# EAGLE design Adafruit 3.5in 480x320 (EAGLE 6.3)
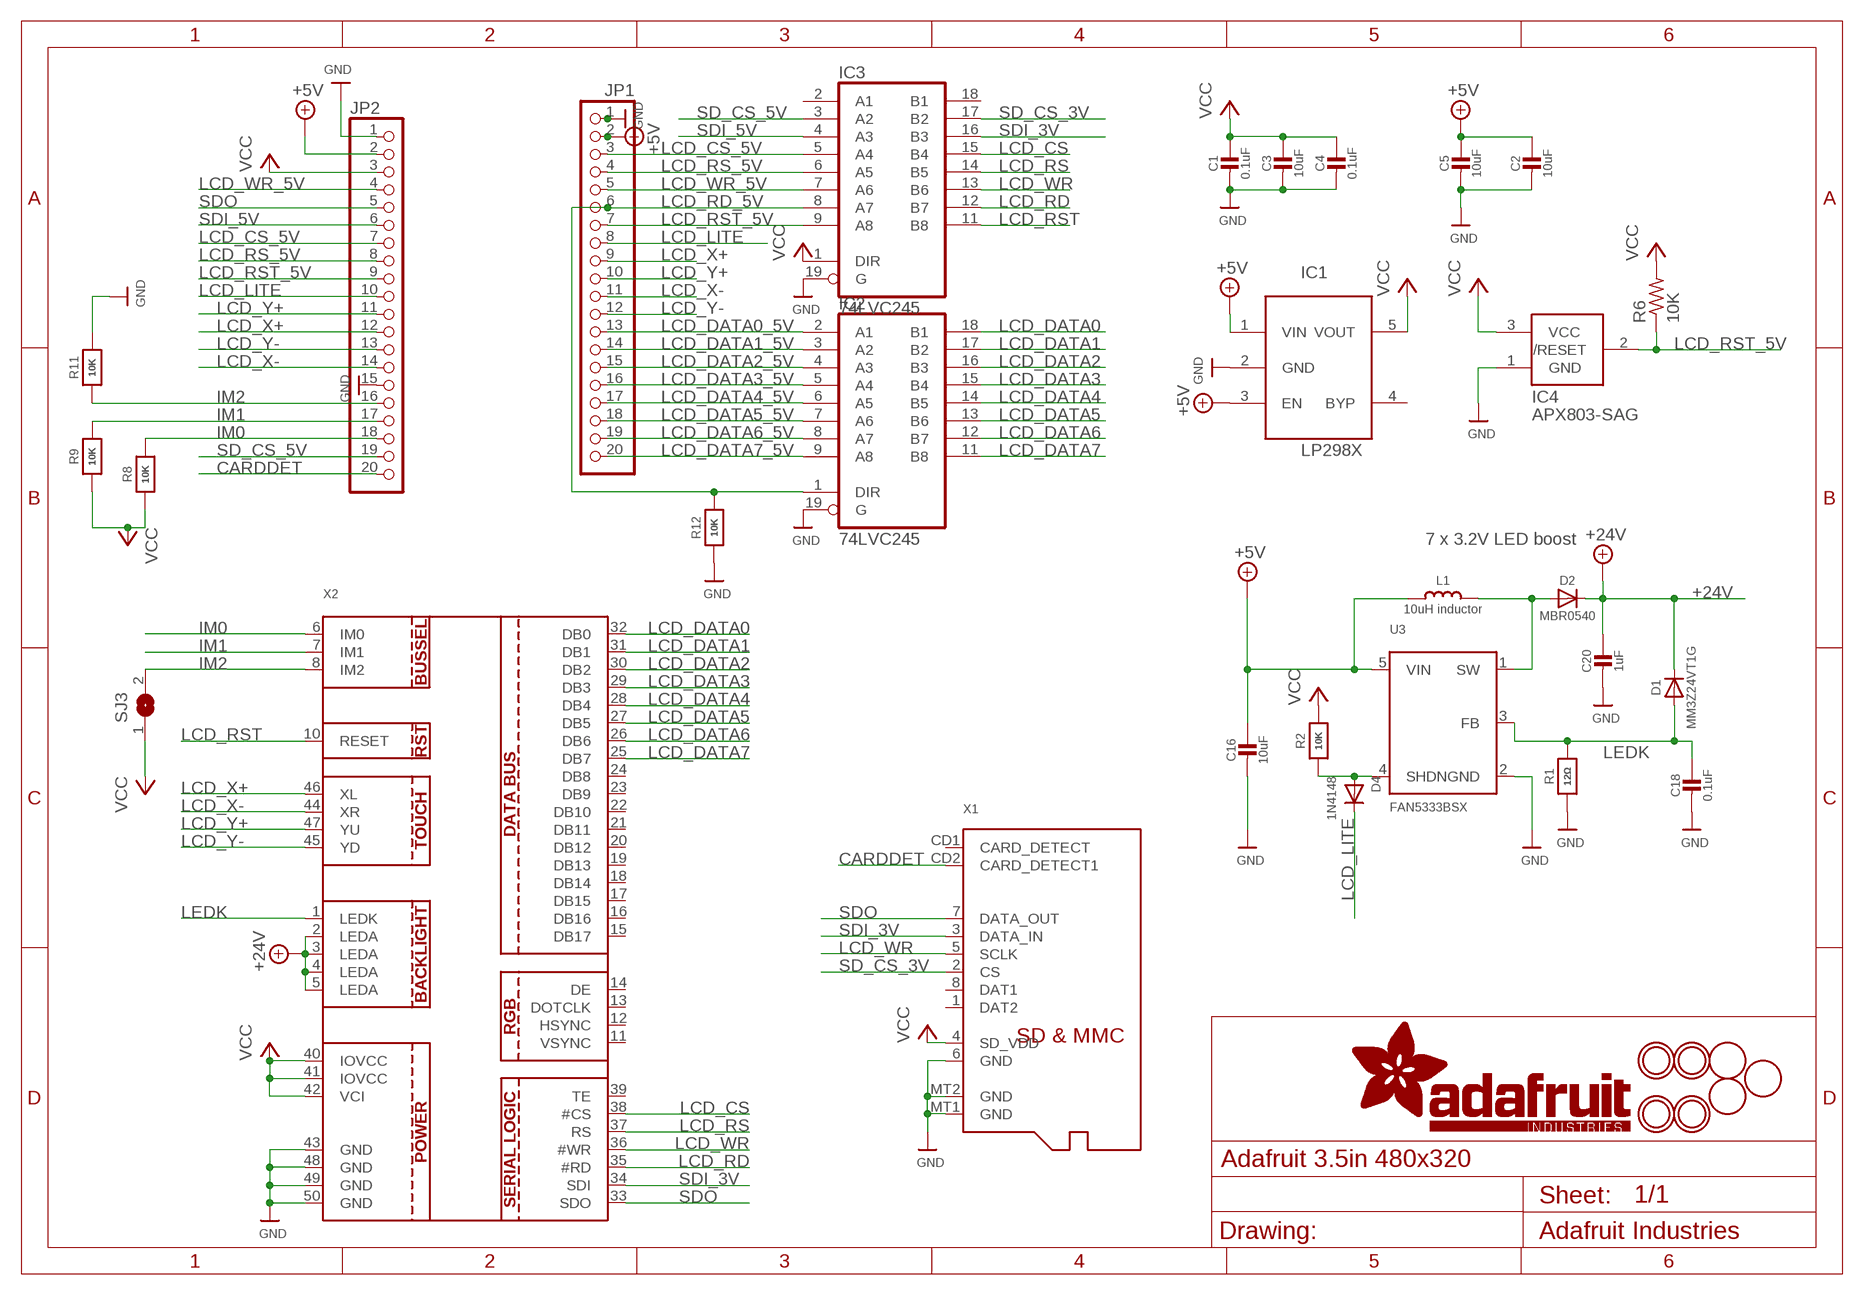
[diagram p0: schematic, sheet 1]

## Parts
C1  0.1uF  CAP_CERAMIC0805-NOOUTLINE  [0805-NO]
C2  10uF  CAP_CERAMIC0805-NOOUTLINE  [0805-NO]
C3  10uF  CAP_CERAMIC0805-NOOUTLINE  [0805-NO]
C4  0.1uF  CAP_CERAMIC0805-NOOUTLINE  [0805-NO]
C5  10uF  CAP_CERAMIC0805-NOOUTLINE  [0805-NO]
C16  10uF  CAP_CERAMIC_0805MP  [_0805MP]
C18  0.1uF  CAP_CERAMIC0805-NOOUTLINE  [0805-NO]
C20  1uF  CAP_CERAMIC0805-NOOUTLINE  [0805-NO]
D1  MM3Z24VT1G  DIODESMA  [SMADIODE]
D2  MBR0540  DIODESOD-123  [SOD-123]
D4  1N4148  DIODESOD-323F  [SOD-323F]
IC1  MIC5225-3.3  LP298XS  [SOT23-5L]
IC2  74LVC245  74ACT245DW  [SO20W]
IC3  74LVC245  74ACT245DW  [SO20W]
IC4  APX803-SAG  AXP083-SAG  [SOT23]
JP1  HEADER-1X20ROUND  [1X20_ROUND]
JP2  HEADER-1X20ROUND  [1X20_ROUND]
L1  10uH inductor  INDUCTORNR5040  [INDUCTOR_5X5MM_NR5040_NOTHERMALS]
R1  12Ω  RESISTOR_0805MP  [_0805MP]
R2  10K  RESISTOR0805_NOOUTLINE  [0805-NO]
R6  10K  R-US_R0805  [R0805]
R8  10K  RESISTOR0805_NOOUTLINE  [0805-NO]
R9  10K  RESISTOR0805_NOOUTLINE  [0805-NO]
R11  10K  RESISTOR0805_NOOUTLINE  [0805-NO]
R12  10K  RESISTOR0805_NOOUTLINE  [0805-NO]
SJ3  SOLDERJUMPER  [SOLDERJUMPER_ARROW_NOPASTE]
U3  FAN5333BSX  FAN5331  [SOT23-5@1]
U$7  MOUNTINGHOLE3.0THIN  [MOUNTINGHOLE_3.0_PLATEDTHIN]
U$9  FIDUCIAL  [FIDUCIAL_1MM]
U$11  FIDUCIAL  [FIDUCIAL_1MM]
U$15  MOUNTINGHOLE3.0THIN  [MOUNTINGHOLE_3.0_PLATEDTHIN]
U$16  MOUNTINGHOLE3.0THIN  [MOUNTINGHOLE_3.0_PLATEDTHIN]
U$17  MOUNTINGHOLE3.0THIN  [MOUNTINGHOLE_3.0_PLATEDTHIN]
U$23  FIDUCIAL  [FIDUCIAL_1MM]
X1  MICROSD  [MICROSD]
X2  DISP_LCD_3.5IN_320X480_50PIN  [TFT_3.5IN_320X480_50PIN]

## Nets
+5V: C2.1 C5.1 C16.1 IC1.1(VIN) IC1.3(EN) JP1.2 JP2.2 L1.P$1 U3.5(VIN)
+24V: C20.1 D1.C D2.C X2.2(LEDA) X2.3(LEDA) X2.4(LEDA) X2.5(LEDA)
CARDDET: JP2.20 X1.CD2(CARD_DETECT1)
GND: C1.2 C2.2 C3.2 C4.2 C5.2 C16.2 C18.2 C20.2 IC1.2(GND) IC2.19(G) IC3.19(G) IC4.1(GND) JP1.1 JP2.1 JP2.15 R1.1 R11.2 R12.1 U3.2(GND) X1.6(GND) X1.MT1(GND) X1.MT2(GND) X2.43(GND) X2.48(GND) X2.49(GND) X2.50(GND)
IM0: JP2.18 R8.2 X2.6(IM0)
IM1: JP2.17 R9.2 X2.7(IM1)
IM2: JP2.16 R11.1 SJ3.2 X2.8(IM2)
LCD_CS: IC3.15(B4) X2.38(#CS)
LCD_CS_5V: IC3.5(A4) JP1.3 JP2.7
LCD_DATA0: IC2.18(B1) X2.32(DB0)
LCD_DATA0_5V: IC2.2(A1) JP1.13
LCD_DATA1: IC2.17(B2) X2.31(DB1)
LCD_DATA1_5V: IC2.3(A2) JP1.14
LCD_DATA2: IC2.16(B3) X2.30(DB2)
LCD_DATA2_5V: IC2.4(A3) JP1.15
LCD_DATA3: IC2.15(B4) X2.29(DB3)
LCD_DATA3_5V: IC2.5(A4) JP1.16
LCD_DATA4: IC2.14(B5) X2.28(DB4)
LCD_DATA4_5V: IC2.6(A5) JP1.17
LCD_DATA5: IC2.13(B6) X2.27(DB5)
LCD_DATA5_5V: IC2.7(A6) JP1.18
LCD_DATA6: IC2.12(B7) X2.26(DB6)
LCD_DATA6_5V: IC2.8(A7) JP1.19
LCD_DATA7: IC2.11(B8) X2.25(DB7)
LCD_DATA7_5V: IC2.9(A8) JP1.20
LCD_LITE: D4.C JP1.8 JP2.10
LCD_RD: IC3.12(B7) X2.35(#RD)
LCD_RD_5V: IC2.1(DIR) IC3.8(A7) JP1.6 R12.2
LCD_RS: IC3.14(B5) X2.37(RS)
LCD_RS_5V: IC3.6(A5) JP1.4 JP2.8
LCD_RST: IC3.11(B8) X2.10(RESET)
LCD_RST_5V: IC3.9(A8) IC4.2(/RESET) JP1.7 JP2.9 R6.1
LCD_WR: IC3.13(B6) X1.5(SCLK) X2.36(#WR)
LCD_WR_5V: IC3.7(A6) JP1.5 JP2.4
LCD_X+: JP1.9 JP2.12 X2.46(XL)
LCD_X-: JP1.11 JP2.14 X2.44(XR)
LCD_Y+: JP1.10 JP2.11 X2.47(YU)
LCD_Y-: JP1.12 JP2.13 X2.45(YD)
LEDK: C18.1 D1.A R1.2 U3.3(FB) X2.1(LEDK)
N$3: D2.A L1.P$2 U3.1(SW)
SD_CS_3V: IC3.17(B2) X1.2(CS)
SD_CS_5V: IC3.3(A2) JP2.19
SDI_3V: IC3.16(B3) X1.3(DATA_IN) X2.34(SDI)
SDI_5V: IC3.4(A3) JP2.6
SDO: JP2.5 X1.7(DATA_OUT) X2.33(SDO)
SHDN: D4.A R2.1 U3.4(SHDN)
VCC: C1.1 C3.1 C4.1 IC1.5(VOUT) IC3.1(DIR) IC4.3(VCC) JP2.3 R2.2 R6.2 R8.1 R9.1 SJ3.1 X1.4(SD_VDD) X2.40(IOVCC) X2.41(IOVCC) X2.42(VCI)
Unconnected: IC1.4(BYP) IC3.2(A1) IC3.18(B1) X1.1(DAT2) X1.8(DAT1) X1.CD1(CARD_DETECT) X2.11(VSYNC) X2.12(HSYNC) X2.13(DOTCLK) X2.14(DE) X2.15(DB17) X2.16(DB16) X2.17(DB15) X2.18(DB14) X2.19(DB13) X2.20(DB12) X2.21(DB11) X2.22(DB10) X2.23(DB9) X2.24(DB8) X2.39(TE)

## Notes on the sheet
- 7 x 3.2V LED boost

## Power pins joined to a net without a drawn wire
GND: IC2.10(GND) IC3.10(GND)
VCC: IC2.20(VCC) IC3.20(VCC)

## Library data of the parts
C1-C5 C16 C18 C20 = microbuilder:CAP_CERAMIC: Ceramic Capacitors For new designs, use the packages preceded by an '_' character since they are more reliable: The following footprints should be used on most boards: _0402 - Standard footprint for regular board layouts _0603 - Standard footprint for regular board layouts _0805 - Standard footprint for regular board layouts _1206 - Standard footprint for regular board layouts For extremely tight-pitch boards where space is at a premium, the following 'micro-pitch' footprints can be used (smaller pads, no silkscreen outline, etc.): _0402MP - Micro-pitch footprint for very dense/compact boards _0603MP - Micro-pitch footprint for very dense/compact boards _0805MP - Micro-pitch footprint for very dense/compact boards _1206MP - Micro-pitch footprint for very dense/compact boards
D1 D2 = microbuilder:DIODE: Diode
D4 = adafruit:DIODE: Diode
IC1 = adafruit:LP298X
IC2 IC3 = 74xx-eu:74*245: Octal BUS TRANSCEIVER, 3-state
IC4 = adafruit:AXP083
JP1 JP2 = microbuilder:HEADER-1X20
L1 = microbuilder:INDUCTOR: Inductors 0603: 10nH Ceramic Inductor - microwire antenna/RF (Digikey: 712-1434-2-ND) 0805: 560nH Ceramic Inductor - RF (Digikey: 553-1047-1-ND) 270nH Ceramic Inductor - Q = 40@250MHz, +-5%, 1 Ohm DC Resistance (Digikey: 535-10506-2-ND) 1007 (2518 Metric) SMT: 10µH 10% 250mOhm 820mA 1007 Inductor (Digikey: 587-2189-1-ND) 22µH 10% 500mOhm 580mA 1007 Inductor (Digikey: 587-2190-1-ND) 47µH 10% 950mOhm 420mA 1007 Inductor (Digikey: 587-2191-1-ND) 47µH 5% 100mOhm 1A 1008 Inductor (Digikey: 732-1816-1-ND) 5.0x5.0mm (Taiyo Yuden NR5040 Series) 6.8µH 20% 2.3A 64mOhm Inductor (Digikey: 587-2374-2-ND) 5.0x5.0mm (TDK VLC5045 Series) 4.7µH 20% 3.3A 34mOhm Inductor (Digikey: 445-6526-1-ND) 6.8µH 20% 2.7A 46mOhm Inductor (Digikey: 445-6527-1-ND) 6.0x6.0mm (TDK VLC6045 Series) 4.7µH 20% 3.8A 27mOhm Inductor (Digikey: 445-6538-2-ND) 6.8µH 20% 3A 41mOhm Inductor (Digikey: 445-6540-1-ND) 6.2µH 30% 2.2A 45mOhm Inductor (Digikey: SRR5028-6R2YCT-ND) - Not TDK VLC6045 but footprint should match 6.0x6.0mm (TDK SLF6045 Series) 6.8uH 30% 2A 33mOhm Inductor (Digikey: 445-4572-1-ND, Mouser: 810-SLF645T6R8N2R0PF) 6.0x6.0mm (Sumida CDRH5D28 Series) 6.2uH 30% 1.8A 45mOhm Inductor (Digikey: 308-1542-1-ND) Taiyo Yuden NR3015T2R2M - 2.2uH 20% 1.5A (Digikey: 587-1648-2-ND, Mouser: 963-NR3015T2R2M) - Used with TI TPS62172 CoilCraft RFID Transponder Coil - MA5532-AE (For use with AS3935 Lightning Sensor)
R1 R2 R8 R9 R11 R12 = microbuilder:RESISTOR: Resistors For new designs, use the packages preceded by an '_' character since they are more reliable: The following footprints should be used on most boards: _0402 - Standard footprint for regular board layouts _0603 - Standard footprint for regular board layouts _0805 - Standard footprint for regular board layouts _1206 - Standard footprint for regular board layouts For extremely tight-pitch boards where space is at a premium, the following 'micro-pitch' footprints can be used (smaller pads, no silkscreen outline, etc.): _0402MP - Micro-pitch footprint for very dense/compact boards _0603MP - Micro-pitch footprint for very dense/compact boards _0805MP - Micro-pitch footprint for very dense/compact boards _1206MP - Micro-pitch footprint for very dense/compact boards
R6 = rcl:R-US_: RESISTOR, American symbol
SJ3 = microbuilder:SOLDERJUMPER: SMD Solder JUMPER Solder the two pads together to create a connection, or remove the solder to break it. REFLOW - Use this footprint for solder paste and reflow ovens. WAVE - Use this footprint for hand-soldering (larger pads). CLOSED - Has a trace between the two pads to ensure it is closed by default. The trace needs to be cut to disable the jumper, and can be closed again by creating a solder bridge between the two pads.; BOM: EXCLUDE
U3 = microbuilder:FAN5331: FAN5331 - LED/OLED 20V Boost Converter Digikey: FAN5331SXCT-ND
U$7 U$15-U$17 = microbuilder:MOUNTINGHOLE: Mounting Hole For #2 screws (0.086"/2.18mm width, 0.094"/2.4mm hole) use 2.5mm; BOM: EXCLUDE
U$9 U$11 U$23 = adafruit:FIDUCIAL: For use by pick and place machines to calibrate the vision/machine, 1mm By microbuilder.eu
X1 = microbuilder:MICROSD: MicroSD/Transflash Card Holder with SPI pinout 3M: 2908-05WB-MG 4UConnector: 19656 Footprint courtesy: Adafruit Industries
X2 = microbuilder:DISP_LCD_3.5IN_320X480_50PIN: DT350HV15-T - 3.5" 320x480 TFT Display, 50 Pin Connector

## Board
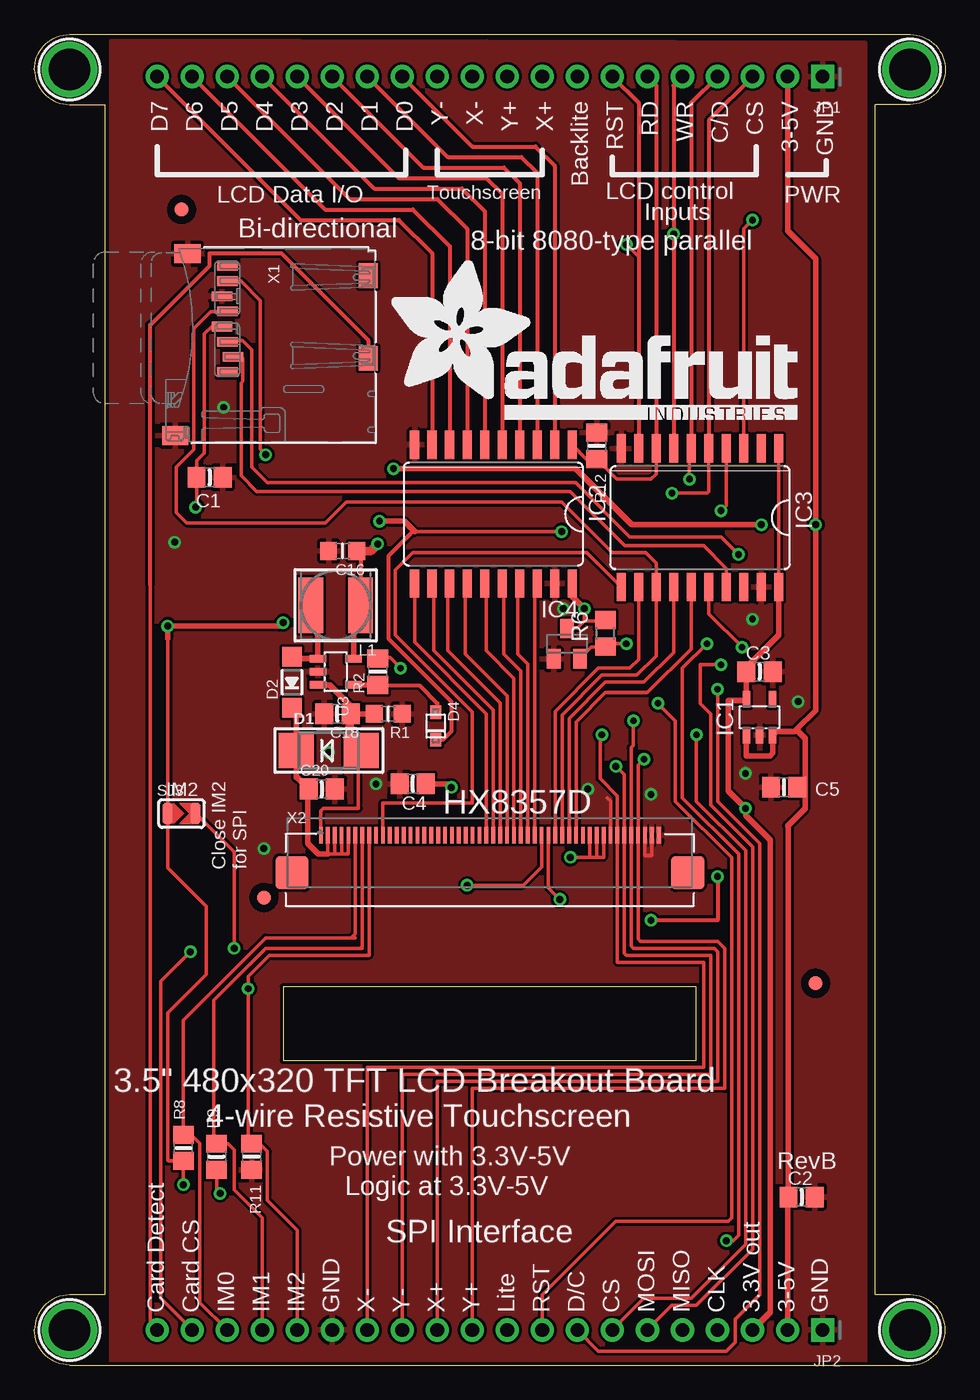
[diagram p1: board, top side]
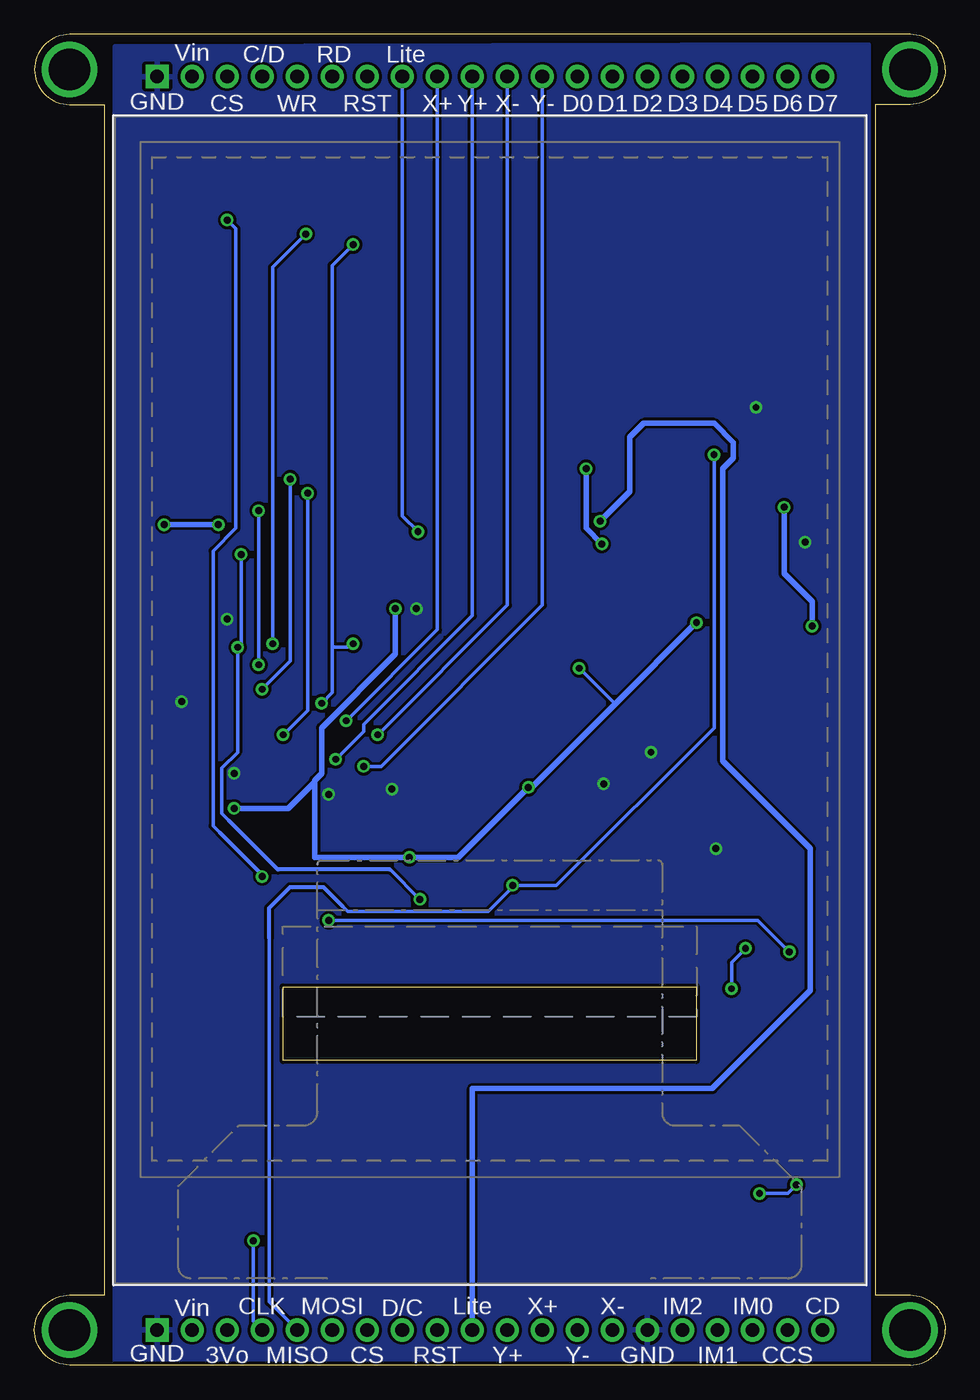
[diagram p2: board, bottom side, seen from below]

Size 66.04 x 96.52 mm. Coordinates in mm from the lower left corner, seen from the top.
Outline: 2.54,0 63.5,0 arc90 66.04,2.54 arc90 63.5,5.08 60.96,5.08 60.96,91.44 63.5,91.44 arc90 66.04,93.98 arc90 63.5,96.52 2.54,96.52 arc90 0,93.98 arc90 2.54,91.44 5.08,91.44 5.08,5.08 2.54,5.08 arc90 0,2.54 arc90 2.54,0
Outline: 18.03,27.43 18.03,22.1 48.01,22.1 48.01,27.43 18.03,27.43
Copper layers (1*16): Top 0.035mm / dielectric 1.5mm / Bottom 0.035mm
Design rules "adafruit": minimum track width 8mil, minimum drill 15.5mil, track to track 8mil, track to pad 8mil, pad to pad 8mil, via to via 8mil, smd to smd 8mil, copper to edge 10mil, drill to drill 8mil, minimum pad ring 10mil, minimum via ring 8mil, stop-mask expansion 2mil, vias tented up to drill 20mil, thermal gap 10mil
tRestrict: area 44.5,38.2 to 44.6,38.6; area 45,38.2 to 45.1,38.6

### Footprints (pad centres in the part's own frame; a part is rotated, then mirrored left to right if it is on the bottom)
0805-NO = smd 1.3 x 1.5: 1 -0.95,0; 2 0.95,0
_0805MP = smd 1.2 x 1.3: 1 -1.016,0; 2 1.016,0
SMADIODE = smd 2.54 x 2.54: A 2.349,0; C -2.349,0
SOD-123 = smd 1.4 x 1.4: A 1.85,0; C -1.85,0
SOD-323F = smd 1 x 0.8: A -1,0; C 1,0
SOT23-5L = smd 0.55 x 1.2: 1 -0.95,-1.3; 2 0,-1.3; 3 0.95,-1.3; 4 0.95,1.3; 5 -0.95,1.3
SO20W = smd 0.66 x 2.032: 1 -5.715,-5.029; 2 -4.445,-5.029; 3 -3.175,-5.029; 4 -1.905,-5.029; 5 -0.635,-5.029; 6 0.635,-5.029; 7 1.905,-5.029; 8 3.175,-5.029; 9 4.445,-5.029; 10 5.715,-5.029; 11 5.715,5.029; 12 4.445,5.029; 13 3.175,5.029; 14 1.905,5.029; 15 0.635,5.029; 16 -0.635,5.029; 17 -1.905,5.029; 18 -3.175,5.029; 19 -4.445,5.029; 20 -5.715,5.029
SOT23 = smd 1 x 1.4: 1 -0.95,-1.1; 2 0.95,-1.1; 3 0,1.1
1X20_ROUND = drill 1 pad 1.676 square: 1 -24.13,0 | drill 1 pad 1.676: 2 -21.59,0; 3 -19.05,0; 4 -16.51,0; 5 -13.97,0; 6 -11.43,0; 7 -8.89,0; 8 -6.35,0; 9 -3.81,0; 10 -1.27,0; 11 1.27,0; 12 3.81,0; 13 6.35,0; 14 8.89,0; 15 11.43,0; 16 13.97,0; 17 16.51,0; 18 19.05,0; 19 21.59,0; 20 24.13,0
INDUCTOR_5X5MM_NR5040_NOTHERMALS = smd 1.8 x 4: P$1 -1.8,0; P$2 1.8,0
R0805 = smd 1.3 x 1.5: 1 -0.95,0; 2 0.95,0
SOLDERJUMPER_ARROW_NOPASTE = smd 0.762 x 1.524: 1 -1.016,0; 2 1.016,0
SOT23-5@1 = smd 0.55 x 1.2: 1 -0.95,-1.3; 2 0,-1.3; 3 0.95,-1.3; 4 0.95,1.3; 5 -0.95,1.3
MOUNTINGHOLE_3.0_PLATEDTHIN = drill 3 pad 3.6: P$1 0,0
FIDUCIAL_1MM = smd 1 x 1: 1 0,0
MICROSD = smd 0.7 x 1.5: 1 9,-10.64; 2 7.9,-10.24; 3 6.8,-10.64; 4 5.7,-11.04; 5 4.6,-10.64; 6 3.5,-11.04; 7 2.4,-10.64; 8 1.3,-10.64 | smd 1.8 x 1.4: CD1 2,-0.44; CD2 8,-0.44 | smd 1.4 x 1.9: MT1 0.4,-13.54; MT2 13.6,-14.44
TFT_3.5IN_320X480_50PIN = smd 0.275 x 1.2 bottom: 1 12.25,-4.76; 2 11.75,-4.76; 3 11.25,-4.76; 4 10.75,-4.76; 5 10.25,-4.76; 6 9.75,-4.76; 7 9.25,-4.76; 8 8.75,-4.76; 9 8.25,-4.76; 10 7.75,-4.76; 11 7.25,-4.76; 12 6.75,-4.76; 13 6.25,-4.76; 14 5.75,-4.76; 15 5.25,-4.76; 16 4.75,-4.76; 17 4.25,-4.76; 18 3.75,-4.76; 19 3.25,-4.76; 20 2.75,-4.76; 21 2.25,-4.76; 22 1.75,-4.76; 23 1.25,-4.76; 24 0.75,-4.76; 25 0.25,-4.76; 26 -0.25,-4.76; 27 -0.75,-4.76; 28 -1.25,-4.76; 29 -1.75,-4.76; 30 -2.25,-4.76; 31 -2.75,-4.76; 32 -3.25,-4.76; 33 -3.75,-4.76; 34 -4.25,-4.76; 35 -4.75,-4.76; 36 -5.25,-4.76; 37 -5.75,-4.76; 38 -6.25,-4.76; 39 -6.75,-4.76; 40 -7.25,-4.76; 41 -7.75,-4.76; 42 -8.25,-4.76; 43 -8.75,-4.76; 44 -9.25,-4.76; 45 -9.75,-4.76; 46 -10.25,-4.76; 47 -10.75,-4.76; 48 -11.25,-4.76; 49 -11.75,-4.76; 50 -12.25,-4.76 | smd 2.4 x 2.4 bottom: PAD1 14.35,-7.46; PAD2 -14.35,-7.46

### Placement (x,y rotation side)
C1  12.7,64.39 0 top
C2  55.63,12.19 0 top
C3  52.58,50.29 0 top
C4  27.43,42.16 180 top
C5  54.36,41.91 180 top
C16  22.35,59.05 180 top
C18  21.97,47.24 180 top
C20  20.83,41.78 0 top
D1  21.34,44.58 0 top
D2  18.67,49.53 90 top
D4  29.08,46.35 270 top
IC1  52.58,46.99 0 top
IC2  33.27,61.72 180 top
IC3  48.26,61.47 180 top
IC4  38.61,52.32 0 top
JP1  33.02,93.47 180 top
JP2  33.02,2.54 180 top
L1  21.84,55.12 180 top
R1  25.65,47.24 180 top
R2  24.89,50.29 90 top
R6  41.4,53.09 90 top
R8  10.8,15.75 90 top
R9  13.21,15.11 90 top
R11  15.75,15.11 270 top
R12  40.77,66.67 270 top
SJ3  10.67,40.01 0 top
U3  21.84,50.29 270 top
U$7  2.54,2.54 0 top
U$9  56.64,27.69 0 top
U$11  10.67,83.82 0 top
U$15  63.5,2.54 0 top
U$16  2.54,93.98 0 top
U$17  63.5,93.98 0 top
U$19  [ADAFRUIT_TEXT_30MM]  25.65,68.58 0 top
U$23  16.64,33.91 0 top
X1  24.64,81.03 270 top
X2  33.02,43.18 0 bottom

### Tracks (layer width: path | path; a pad name or v marks a point on that pad's centre or on a via)
+5V  (via drill 0.5)
  Top 0.305: C16.1 23.64,58.78 L1.P$1
  Top 0.406: JP1.2 54.61,82.3 56.64,80.26 v56.64,60.96 56.64,47.5 55.25,46.1 | 55.25,46.1 55.12,45.97 53.81,45.97 IC1.3 53.53,44.38 53.34,44.2 51.63,44.2 IC1.1 | 55.88,41.91 55.88,40.39 54.61,39.12 54.68,39.05 C2.1 54.61,12.13 JP2.2 54.63,2.56 | 55.88,41.91 55.88,45.47 55.25,46.1 | C5.1 55.88,41.91 | L1.P$1 23.14,55.12 U3.5 | v26.04,65.02 39.24,65.02 43.31,60.96 v52.7,60.96
  Top 0.61: C16.1 24.38,59.05 v24.89,59.56
  Bottom 0.254: 54.61,92.84 JP1.2
  Bottom 0.406: v24.89,59.56 26.04,60.71 v26.04,65.02 | v52.7,60.96 v56.64,60.96
+24V
  Top 0.254: X2.2 21.27,37.08 21.77,37.08 | 22.77,38.1 X2.5 22.77,37.08 22.27,37.08 | 22.27,38.14 X2.4 22.27,37.08 | X2.3 21.77,37.08 | 22.27,37.08 21.77,37.08
  Top 0.406: D2.C 18.99,47.36 D1.C 18.99,42.61 19.05,42.61 C20.1 19.81,41.72 19.81,37.85 20.57,37.08 21.27,37.08
CARDDET
  Top 0.254: JP2.20 8.38,3.05 8.38,56.64
  Top 0.305: 8.38,56.64 8.38,75.44 12.7,79.76 12.7,80.65 17.91,80.65 24.2,74.35 X1.CD2
GND  (via drill 0.5)
  Top 0.254: X2.43 41.77,40.91 41.53,41.15 | X2.48 44.27,36.96 44.77,36.96 X2.49
  other vias: 38.35,54.86 52.07,54.1 40.13,41.78 44.7,41.4 51.56,42.93 55.37,48.13 16.64,37.47 10.16,59.69 21.34,44.45 24.77,42.16 13.72,69.47
  pour Top: 5.59,96.01 5.59,0 60.2,-0.13 60.2,95.88
  pour Bottom: 5.59,95.76 5.59,-0.25 60.2,-0.38 60.2,95.63
IM0
  Top 0.254: 22.99,30.99 16.76,30.99 10.8,25.02 R8.2 11.37,16.7 12,16.07 12,4.51 JP2.18 | 22.99,30.99 23.27,30.99 | X2.6 23.27,31.27 22.99,30.99
IM1
  Top 0.254: 23.77,30.23 23.62,30.23 | 23.62,30.23 16.76,30.23 13,26.47 13,16.27 R9.2 14.04,16.06 14.48,15.62 14.48,12.7 16.51,10.67 JP2.17 | X2.7 23.77,30.37 23.62,30.23
IM2  (via drill 0.5)
  Top 0.254: JP2.16 19.05,9.78 16.89,11.94 16.89,15.49 16.26,16.13 15.81,16.13 R11.1 15.49,16.32 v15.49,27.3 15.49,28.19 17.02,29.72 24.27,29.72 X2.8 | SJ3.2 14.48,37.21 v14.48,30.23
  Bottom 0.254: v14.48,30.23 15.49,29.21 v15.49,27.3
LCD_CS
  Top 0.254: 47.75,56.31 IC3.15 47.62,51.94 44.45,48.77 41.4,48.77 39.27,46.64 X2.38
LCD_CS_5V  (via drill 0.5)
  Top 0.254: JP2.7 44.2,4.83 47.62,4.83 51.56,8.76 51.56,37.34 48.01,40.89 v48.01,45.72 | v46.23,63.25 48.77,63.25 48.9,63.37 IC3.5
  Top 0.305: JP1.3 48.9,90.3 IC3.5
  Bottom 0.254: v48.01,45.72 46.23,47.5 v46.23,63.25
LCD_DATA0
  Top 0.254: IC2.18 36.27,56.51 X2.32
LCD_DATA0_5V
  Top 0.305: JP1.13 31.75,88.39 36.32,88.39 37.72,87 IC2.2
LCD_DATA1
  Top 0.254: IC2.17 35.05,56.57 35.05,51.56 35.77,50.84 X2.31
LCD_DATA1_5V
  Top 0.305: JP1.14 29.97,87.63 35.31,87.63 36.45,86.49 IC2.3
LCD_DATA2
  Top 0.254: IC2.16 34.04,56.57 34.04,51.56 35.27,50.33 X2.30
LCD_DATA2_5V
  Top 0.305: JP1.15 28.19,86.87 34.04,86.87 35.18,85.72 IC2.4
LCD_DATA3
  Top 0.254: IC2.15 32.77,56.57 32.77,51.82 34.77,49.81 X2.29
LCD_DATA3_5V
  Top 0.305: JP1.16 26.42,86.11 32.77,86.11 33.91,84.96 IC2.5
LCD_DATA4
  Top 0.254: IC2.14 31.24,56.57 31.24,51.56 34.27,48.53 X2.28
LCD_DATA4_5V
  Top 0.305: JP1.17 24.64,85.34 30.99,85.34 32.64,83.69 IC2.6
LCD_DATA5
  Top 0.254: IC2.13 29.97,56.57 29.97,51.82 33.77,48.02 X2.27
LCD_DATA5_5V
  Top 0.305: JP1.18 22.86,84.58 29.21,84.58 31.37,82.42 IC2.7
LCD_DATA6
  Top 0.254: IC2.12 28.96,56.57 28.96,51.82 33.27,47.5 X2.26
LCD_DATA6_5V
  Top 0.305: JP1.19 21.08,83.82 27.43,83.82 30.1,81.15 IC2.8
LCD_DATA7
  Top 0.254: IC2.11 27.56,52.45 32.77,47.24 X2.25
LCD_DATA7_5V
  Top 0.305: JP1.20 19.3,83.06 26.42,83.06 28.83,80.65 IC2.9
LCD_LITE  (via drill 0.5)
  Top 0.254: 27.43,60.45 27.56,60.45 v38.23,60.45
  Top 0.305: 27.43,60.45 25.65,58.67 25.65,52.7 30.23,48.13 30.23,45.97 29.61,45.35 D4.C
  Top 0.406: v25.02,61.21 26.8,61.21 27.56,60.45
  Bottom 0.254: v38.23,60.45 39.37,61.59 JP1.8
  Bottom 0.406: JP2.10 34.29,20.07 16.89,20.07 9.78,27.18 9.78,37.47 16.13,43.81 16.13,65.02 15.37,65.79 15.37,66.93 16.76,68.33 21.84,68.33 22.86,67.31 22.86,63.37 v25.02,61.21
LCD_RD
  Top 0.254: 43.69,56.31 IC3.12 43.82,51.18 43.18,50.55 40.89,50.55 37.77,47.42 X2.35
LCD_RD_5V
  Top 0.254: IC2.1 40.02,65.72 R12.2 42.23,64.26 44.7,64.26 45.09,64.64 IC3.8
  Top 0.305: JP1.6 45.09,92.84 IC3.8
LCD_RS
  Top 0.254: 46.23,56.31 IC3.14 46.36,51.69 44.2,49.53 41.4,49.53 38.77,46.9 X2.37
LCD_RS_5V  (via drill 0.5)
  Top 0.254: v49.53,49.02 49.53,40.89 52.58,37.85 52.58,5.08 50.8,3.3 50.8,1.65 50.17,1.02 40.89,1.02 JP2.8 | IC3.6 47.5,66.37 v47.5,64.26
  Top 0.305: JP1.4 47.62,91.57 IC3.6
  Bottom 0.254: v49.53,49.02 47.5,51.05 v47.5,64.26
LCD_RST
  Top 0.254: IC3.11 40.06,58.93 27.43,58.93 26.16,57.66 26.16,52.96 31.75,47.37 31.75,40.77 25.27,40.77 X2.10
LCD_RST_5V  (via drill 0.5)
  Top 0.254: v45.21,48.01 46.48,46.74 46.48,40.89 50.55,36.83 50.55,10.67 50.29,10.41 42.16,10.41 36.83,5.08 JP2.9 | v42.93,81.28 43.82,80.39 IC3.9 | v42.93,52.32 41.59,52.32 R6.1 41.34,52.07 40.37,52.07 39.56,51.26 IC4.2
  Top 0.305: JP1.7 43.82,91.57 IC3.9
  Bottom 0.254: v45.21,48.01 44.45,48.77 44.45,52.07 | 44.45,52.07 44.45,79.76 v42.93,81.28 | v42.93,52.32 43.18,52.07 44.45,52.07
LCD_WR
  Top 0.254: 45.21,56.31 IC3.13 | IC3.13 45.09,51.44 43.69,50.04 41.15,50.04 38.27,47.16 X2.36 | X1.5 12.8,76.43 11.56,75.18 11.56,66.42 10.29,65.15 10.29,61.85 11.05,61.09 21.08,61.09 22.61,62.61 38.23,62.61 41.91,58.93 44.32,58.93 45.09,58.17 IC3.13
LCD_WR_5V  (via drill 0.5)
  Top 0.254: v48.77,52.32 46.99,50.55 46.99,41.15 51.05,37.08 51.05,9.4 50.67,9.02 v50.17,9.02 | 46.48,66.37 IC3.7
  Top 0.305: JP1.5 46.36,92.84 v46.36,82.04 IC3.7
  Bottom 0.254: v48.77,52.32 48.77,79.63 v46.36,82.04 | v50.17,9.02 50.17,3.17 JP2.4
LCD_X+  (via drill 0.5)
  Top 0.254: v43.43,46.74 43.43,44.96 43.27,44.79 X2.46 43.27,30.39 43.43,30.23 49.28,30.23 49.53,29.97 49.53,20.57 29.21,20.57 JP2.12
  Bottom 0.254: v43.43,46.74 36.83,53.34 JP1.9
LCD_X-  (via drill 0.5)
  Top 0.254: JP2.14 24.13,21.59 48.51,21.59 48.51,29.21 42.27,29.21 X2.44 42.27,41.3 41.02,42.55 41.02,45.59 v41.15,45.72
  Bottom 0.254: v41.15,45.72 31.75,55.12 JP1.11
LCD_Y+  (via drill 0.5)
  Top 0.254: v44.2,43.94 43.77,43.52 X2.47 43.77,30.91 43.94,30.73 49.53,30.73 50.04,30.23 50.04,20.07 31.75,20.07 JP2.11
  Bottom 0.254: v44.2,43.94 42.16,45.97 42.16,46.48 34.29,54.36 JP1.10
LCD_Y-  (via drill 0.5)
  Top 0.254: JP2.13 26.67,21.08 49.02,21.08 49.02,29.72 42.93,29.72 42.77,29.87 X2.45 42.77,42.83 v42.16,43.43
  Bottom 0.254: v42.16,43.43 40.89,43.43 29.21,55.12 JP1.12
LEDK
  Top 0.254: X2.1 20.77,40.2 20.96,40.39 23.5,40.39 23.5,44.39 D1.A
  Top 0.406: C18.1 R1.2 | D1.A 23.34,44.93 22.99,45.27 | U3.3 21.4,49.34 22.86,47.88 22.86,47.37
  Top 0.61: 23.34,44.93 22.86,45.4 22.86,47.37 22.92,47.31 C18.1
N$3
  Top 0.406: L1.P$2 20.54,54.62 U3.1 18.81,51.24 D2.A
SD_CS_3V
  Top 0.254: IC3.17 50.17,57.78 48.51,59.44 42.8,59.44 38.86,63.37 16.13,63.37 14.99,64.52 14.99,71.25 15.11,71.37 15.11,73.03 14.99,73.15 14.42,73.15 X1.2
SD_CS_5V  (via drill 0.5)
  Top 0.254: IC3.3 51.44,82.42 v52.07,83.06 | JP2.19 9.14,4.83 9.14,27.81 v11.3,29.97
  Top 0.305: v49.53,35.43 49.53,32.26 v44.7,32.26
  Bottom 0.254: v52.07,83.06 51.44,82.42 51.44,60.71 53.09,59.05 53.09,39.12 52.58,38.61 | v44.7,32.26 13.59,32.26 v11.3,29.97
  Bottom 0.305: 52.58,38.61 49.53,35.56 v49.53,35.43
SDI_3V  (via drill 0.5)
  Top 0.254: IC3.16 48.9,54.48 v51.31,52.07 | v51.05,58.8 49.78,60.07 43.18,60.07 39.24,64.01 16.89,64.01 15.75,65.15 15.75,73.66 15.11,74.3 14.07,74.3 X1.3 | X2.34 37.27,34.61 v38.1,33.78
  Bottom 0.254: 51.94,39.5 52.45,40.01 52.45,43.31 51.31,44.45 v51.31,52.07 51.05,52.32 v51.05,58.8 | 40.26,35.94 v38.1,33.78
  Bottom 0.305: 40.26,35.94 48.39,35.94 51.94,39.5
SDI_5V  (via drill 0.5)
  Top 0.254: JP2.6 46.23,4.32 48.01,4.32 52.07,8.38 52.07,37.59 49.02,40.64 49.02,47.24 48.26,48.01 48.26,50.8 v49.78,50.8 | IC3.4 50.17,62.36 v49.78,61.98
  Bottom 0.254: v49.78,50.8 v49.78,61.98
SDO  (via drill 0.5)
  Top 0.254: v31.37,34.8 35.44,34.8 36.77,36.13 X2.33 | v16.76,66.04 16.37,66.43 16.37,77.23 14.99,78.61 14.01,78.61 X1.7
  Bottom 0.254: JP2.5 49.02,4.57 49.02,30.99 | 43.69,33.27 43.31,32.89 33.15,32.89 31.37,34.67 v31.37,34.8 28.19,34.8 16.76,46.23 v16.76,66.04
  Bottom 0.305: 49.02,30.99 49.02,33.15 47.5,34.67 45.09,34.67 43.69,33.27
SHDN
  Top 0.254: 27.94,49.28 24.96,49.28 R2.1
  Top 0.305: 27.94,49.28 29.21,48.01 29.21,47.48 D4.A
  Top 0.406: U3.4 R2.1
VCC  (via drill 0.5)
  Top 0.254: IC3.20 IC3.1 | 40.26,38.48 40.27,38.49 X2.40 40.27,36.83 | 40.77,38.48 X2.41 40.77,36.83 | X1.4 12.84,75.33 12.32,74.8 12.32,66.17 11.75,65.6 C1.1 11.75,62.3 v11.68,62.23 | 9.65,52.7 SJ3.1 9.65,36.07 12.45,33.27 12.45,28.32 9.65,25.53 9.65,14.86 9.71,14.8 R8.1 10.86,14.73 11.18,14.73 10.8,14.35 v10.8,13.08 | v26.54,50.55 25.78,51.31 24.96,51.31 R2.2 | v13.46,12.45 13.21,12.7 R9.1 | 40.27,36.83 v38.86,36.83 | 40.77,36.83 40.27,36.83 | X2.42 41.27,36.83 40.77,36.83 | v39.88,54.86 39.88,53.98 | 39.88,53.98 39.37,53.47 38.65,53.47 IC4.3 | 39.88,53.98 41.34,53.98 R6.2
  Top 0.406: IC3.20 53.98,52.96 51.58,50.56 51.58,50.34 C3.1 IC1.5 51.53,48.19 50.29,48.19 50.29,41.66 v51.56,40.39 51.58,40.39 51.58,39.86 53.34,38.1 53.34,3.81 JP2.3 | 30.04,42.1 v30.23,41.91 29.97,42.16 C4.1 | IC2.20 38.99,55.75 v39.88,54.86 | 9.65,52.7 v9.65,53.59 17.78,53.59 v18.03,53.85
  Bottom 0.254: v26.54,50.55 23.94,47.94 | v10.8,13.08 11.43,12.45 v13.46,12.45
  Bottom 0.406: v30.23,41.91 30.48,41.66 | 30.48,41.66 35.31,36.83 v38.86,36.83 45.72,36.83 45.72,42.29 | 45.72,42.29 45.72,42.42 45.21,42.93 45.21,46.23 39.88,51.56 v39.88,54.86 | v11.68,62.23 11.68,57.4 9.65,55.37 v9.65,53.59 | 45.72,42.29 47.62,40.39 v51.56,40.39 | 30.48,41.66 30.23,41.66 23.94,47.94 v18.03,53.85

### Text on the board
tPlace: D7 | D6 | D5 | D4 | D3 | D2 | D1 | D0 | Y- | X- | Y+ | X+ | Backlite | RST | RD | WR | C/D | CS | 3-5V | GND | LCD Data I/O | Touchscreen | LCD control | PWR | Inputs | Bi-directional | 8-bit 8080-type parallel | IM2 | HX8357D | Close IM2 / for SPI | 3.5" 480x320 TFT LCD Breakout Board | 4-wire Resistive Touchscreen | Power with 3.3V-5V | RevB | Logic at 3.3V-5V | SPI Interface | Card Detect | Card CS | IM0 | IM1 | IM2 | GND | X- | Y- | X+ | Y+ | Lite | RST | D/C | CS | MOSI | MISO | CLK | 3.3V out | 3-5V | GND
bPlace: Lite | RD | C/D | Vin | D7 | D6 | D5 | D4 | D3 | D2 | D1 | D0 | Y- | X- | Y+ | X+ | RST | WR | CS | GND | CD | IM0 | IM2 | X- | X+ | Lite | MOSI | CLK | D/C | Vin | CCS | IM1 | GND | Y- | Y+ | RST | CS | MISO | 3Vo | GND